# Altium schematic sheet Motor_Driver.SchDoc: Motor Driver
size A4; Author: Eladio Delgado Mingorance; CompanyName: bq - Mundo Reader; Organization: bq - Mundo Reader; Revision: 1.4; SheetNumber: 7; SheetTotal: 10
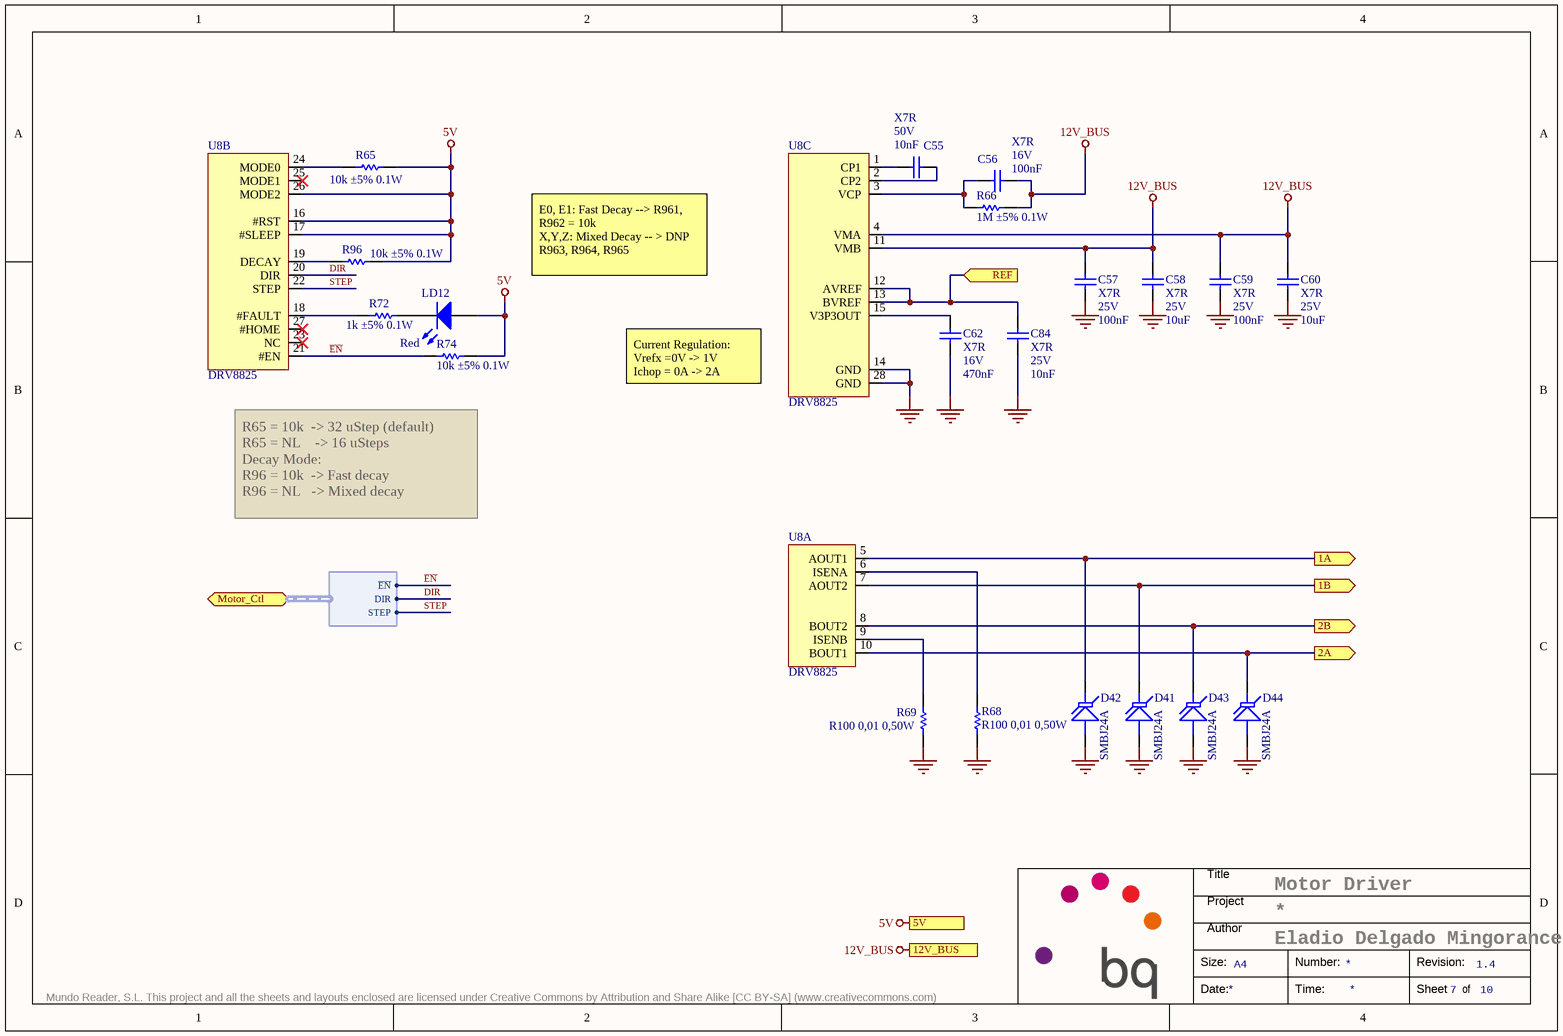
[diagram p0: Motor_Driver.SchDoc]

## Parts
C55  Dielectric: X7R  Voltage: 50V  Capacitance: 10nF  [C0805]  (hidden comment: Capacitor)
C56  Dielectric: X7R  Voltage: 16V  Capacitance: 100nF  [C0603]  (hidden comment: Capacitor)
C57  Dielectric: X7R  Voltage: 25V  Capacitance: 100nF  [C0603]  (hidden comment: Capacitor)
C58  Dielectric: X7R  Voltage: 25V  Capacitance: 10uF  [C1206]  (hidden comment: Capacitor)
C59  Dielectric: X7R  Voltage: 25V  Capacitance: 100nF  [C0603]  (hidden comment: Capacitor)
C60  Dielectric: X7R  Voltage: 25V  Capacitance: 10uF  [C1206]  (hidden comment: Capacitor)
C62  Dielectric: X7R  Voltage: 16V  Capacitance: 470nF  [C0603]  (hidden comment: Capacitor)
C84  Dielectric: X7R  Voltage: 25V  Capacitance: 10nF  [C0603]  (hidden comment: Capacitor)
D41  SMBJ24A  [DO-214AA]
D42  SMBJ24A  [DO-214AA]
D43  SMBJ24A  [DO-214AA]
D44  SMBJ24A  [DO-214AA]
LD12  Red  [LED0603]
R65  value 10k ±5% 0.1W  [R0603]  (hidden comment: Resistor)
R66  value 1M ±5% 0.1W  [R0603]  (hidden comment: Resistor)
R68  value R100 0,01 0,50W  [R1206]  (hidden comment: Resistor)
R69  value R100 0,01 0,50W  [R1206]  (hidden comment: Resistor)
R72  value 1k ±5% 0.1W  [R0603]  (hidden comment: Resistor)
R74  value 10k ±5% 0.1W  [R0603]  (hidden comment: Resistor)
R96  value 10k ±5% 0.1W  [R0603]  (hidden comment: Resistor)
U8  DRV8825  [SOP28]  (parts A,B,C of 3)

## Ports
1A (out), 1B (out), 2A (out), 2B (out), 5V, 12V_BUS, Motor_Ctl (harness Motor_Ctl), REF (in)

## Harnesses
Motor_Ctl: ~{EN}, DIR, STEP

## Nets
5V: LD12.A R65.1 R74.2 R96.1 U8.16(#RST) U8.17(#SLEEP) U8.26(MODE2) ; port 5V
12V_BUS: C56.1 C57.2 C58.2 C59.2 C60.2 R66.2 U8.4(VMA) U8.11(VMB) ; port 12V_BUS
GND: C57.1 C58.1 C59.1 C60.1 C62.1 C84.1 D41.A D42.A D43.A D44.A R68.1 R69.1 U8.14(GND) U8.28(GND)
1A: D42.K U8.5(AOUT1) ; port 1A
1B: D41.K U8.7(AOUT2) ; port 1B
2A: D44.K U8.10(BOUT1) ; port 2A
2B: D43.K U8.8(BOUT2) ; port 2B
~{EN}: R74.1 U8.21(#EN) ; port Motor_Ctl.~{EN}
DIR: U8.20(DIR) ; port Motor_Ctl.DIR
REF: C84.2 U8.12(AVREF) U8.13(BVREF) ; port REF
STEP: U8.22(STEP) ; port Motor_Ctl.STEP
NetC55_1: C55.1 U8.2(CP2)
NetC55_2: C55.2 U8.1(CP1)
NetC56_2: C56.2 R66.1 U8.3(VCP)
NetC62_2: C62.2 U8.15(V3P3OUT)
NetLD12_K: LD12.K R72.2
NetR65_2: R65.2 U8.24(MODE0)
NetR68_2: R68.2 U8.6(ISENA)
NetR69_2: R69.2 U8.9(ISENB)
NetR72_1: R72.1 U8.18(#FAULT)
NetR96_2: R96.2 U8.19(DECAY)

Not connected (* = marked no-connect by the designer): U8 23(NC)* 25(MODE1)* 27(#HOME)*

## Notes on the sheet
- E0, E1: Fast Decay --> R961, R962 = 10k
  X,Y,Z: Mixed Decay -- > DNP R963, R964, R965
- Current Regulation:
  Vrefx =0V -> 1V
  Ichop = 0A -> 2A
- R65 = 10k  -> 32 uStep (default)
  R65 = NL    -> 16 uSteps
  Decay Mode:
  R96 = 10k  -> Fast decay
  R96 = NL   -> Mixed decay
- Title
- Project
- Size:
- Author
- A4
- Number:
- Revision:
- Mundo Reader, S.L. This project and all the sheets and layouts enclosed are licensed under Creative Commons by Attribution and Share Alike [CC BY-SA] (www.creativecommons.com)
- Date:
- Time:
- Sheet
- of

## Library data of the parts
C55 = C0805_10nF_50V_±10%: Capacitor SMD; Manufacturer: Kemet; Value: 10nF ±10% 50V; Tolerance: ±10%; OrderingCode: C0805C103K5RAC; Temp_ Max: 125; Temp_ Min: -55; Part Number: C0805_10nF_50V_±10%; Price (€): 0,035
C56 = C0603_100nF_16V_±10%: Capacitor SMD; Manufacturer: Kemet; Value: 100nF ±10% 16V; Tolerance: ±10%; OrderingCode: C0603C104K4RAC; Temp_ Max: 125; Temp_ Min: -55; Part Number: C0603_100nF_16V_±10%; Price (€): 0,012
C57 C59 = C0603_100nF_25V_±10%: Capacitor SMD; Manufacturer: Kemet; Value: 100nF ±10% 25V; Tolerance: ±10%; OrderingCode: C0603C104K3RAC; Temp_ Max: 125; Temp_ Min: -55; Part Number: C0603_100nF_25V_±10%; Price (€): 0,035
C58 C60 = C1206_10uF_25V_±10%: Capacitor SMD; Manufacturer: Taiyo Yuden; Value: 10uF ±10% 25V; Tolerance: ±10%; OrderingCode: TMK316B7106KL-TD; Temp_ Max: 125; Temp_ Min: -55; Part Number: C1206_10uF_25V_±10%; Price (€): 0,066
C62 = C0603_470nF_16V_±10%: Capacitor SMD; Manufacturer: Kemet; Value: 470nF ±10% 16V; Tolerance: ±10%; OrderingCode: C0603C474K4RAC; Temp_ Max: 125; Temp_ Min: -55; Part Number: C0603_470nF_16V_±10%; Price (€): 0,012
C84 = C0603_10nF_25V_±10%: Capacitor SMD; Manufacturer: Kemet; Value: 10nF ±10% 25V; Tolerance: ±10%; OrderingCode: C0603C103K3RAC; Temp_ Max: 125; Temp_ Min: -55; Part Number: C0603_10nF_25V_±10%; Price (€): 0,035
D41-D44 = TVS 24Vdc: Transient Suppression Diodes; Manufacturer: Littelfuse; Voltage: 24Vdc; Breakdown Voltage: 26,7Vdc; Overvoltage Current: 15,5A; Temp_ Max: 150; Temp_ Min: -65; Part Number: TVS 24Vdc; OrderingCode: SMBJ24A; Price (€): 0,108; Manufacturer 2: Fairchild; OrderingCode 2: SMBJ24A
LD12 = HSMH-C190: LED; Manufacturer: Avago Technologies; Temp_ Max: 85; Temp_ Min: -40; OrderingCode 2: LS Q976-NR-1; Part Number: HSMH-C190; OrderingCode: HSMH-C190; Price (€): 0,064; Manufacturer 2: OSRAM Opto; Value: Red
R65 R74 R96 = R0603_10k_0.1W_±5%: Resistor, SMD; Manufacturer: Vishay; Tolerance: ±5%; OrderingCode: CRCW060310K0JN; Power: 0.1W; Resistance: 10k; Temp_ Max: 155; Temp_ Min: -55; PackageDescription: SMD; Part Number: R0603_10k_0.1W_±5%; Price (€): 0,003
R66 = R0603_1M_0.1W_±5%: Resistor, SMD; Manufacturer: Vishay; Tolerance: ±5%; OrderingCode: CRCW06031M00JN; Power: 0.1W; Resistance: 1M; Temp_ Max: 155; Temp_ Min: -55; PackageDescription: SMD; Part Number: R0603_1M_0.1W_±5%; Price (€): 0,003
R68 R69 = SensR_R1206_R100_0,50W: Resistor, current sensor; Manufacturer: Bourns; Tolerance: 0,01; OrderingCode: CRM1206-FX-R100ELF; Power: 0,50W; Resistance: R100; TCR: 100 ppm/K; Temp_ Max: 155; Temp_ Min: -55; OrderingCode 2: CSR1206FTR100; PackageDescription: SMD; Part Number: SensR_R1206_R100_0,50W; Price (€): 0,084; Manufacturer 2: Stackpole electronics
R72 = R0603_1k_0.1W_±5%: Resistor, SMD; Manufacturer: Vishay; Tolerance: ±5%; OrderingCode: CRCW06031K00JN; Power: 0.1W; Resistance: 1k; Temp_ Max: 155; Temp_ Min: -55; PackageDescription: SMD; Part Number: R0603_1k_0.1W_±5%; Price (€): 0,003
U8 = DRV8825: Stepper Motor Controller IC; Manufacturer: Texas Instruments; OrderingCode: DRV8825PWPR; Temp_ Max: 85; Temp_ Min: -40; Part Number: DRV8825; Supplier: Silica; Price (€): 2,4